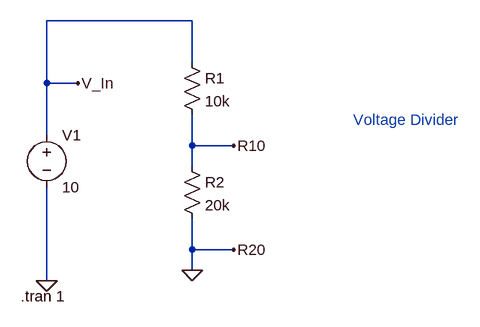
[diagram p0: schematic Voltage_Divider.asc]
Voltage_Divider.asc, the LTspice schematic file:
Version 4.1
SHEET 1 880 680
WIRE 272 -48 48 -48
WIRE 272 16 272 -48
WIRE 48 48 48 -48
WIRE 96 48 48 48
WIRE 48 128 48 48
WIRE 272 144 272 96
WIRE 336 144 272 144
WIRE 272 176 272 144
WIRE 272 304 272 256
WIRE 336 304 272 304
WIRE 272 336 272 304
WIRE 48 352 48 208
FLAG 48 352 0
FLAG 272 336 0
FLAG 96 48 V_In
FLAG 336 144 R10
FLAG 336 304 R20
SYMBOL voltage 48 112 R0
WINDOW 123 0 0 Left 0
WINDOW 39 0 0 Left 0
SYMATTR InstName V1
SYMATTR Value 10
SYMBOL res 256 0 R0
SYMATTR InstName R1
SYMATTR Value 10k
SYMBOL res 256 160 R0
SYMATTR InstName R2
SYMATTR Value 20k
TEXT 8 376 Left 2 !.tran 1
TEXT 520 104 Left 2 ;Voltage Divider

The netlist it stands for:
* Voltage_Divider.asc
V1 V_In 0 10
R1 V_In R10 10k
R2 R10 0 20k
.tran 1
* Voltage Divider
.backanno
.end